# Altium project DIOT-mini-backplane.PrjPCB
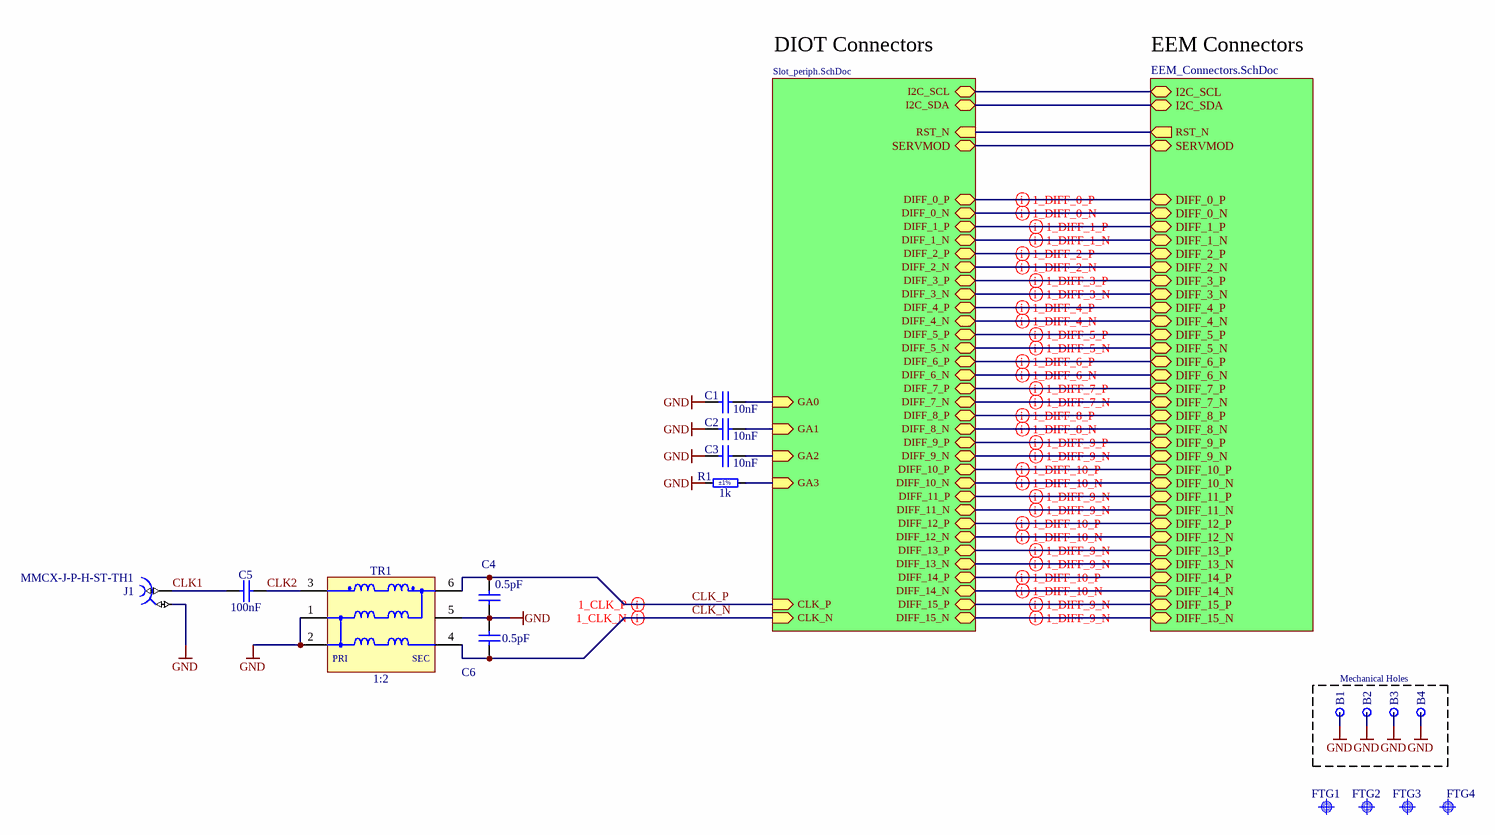
[diagram p0: DIOT-mini-backplane.SchDoc]
Addr1: WUT ISE; Addr2: Nowowiejska 15/19 00-665 Warsaw; LastMod: F.Switakowski; rev: 1.0.0; title_: DI/OT Backplane
3 sheets, 42 parts. Net scope: hierarchical (ports join the sheet entries above them; power ports are global).
Board file: DIOT-mini-backplane.pcbdoc
Sheets:
  DIOT-mini-backplane.SchDoc
    Peripheral Slot 1 = Slot_periph.SchDoc
    U_LVDS_EEM0 = EEM_Connectors.SchDoc

## Sheet DIOT-mini-backplane.SchDoc: =title_
size 594 x 420 mm; Date: 24/04/2023; CheckedBy: EG; GD; GK; MS; DrawnBy: M. Gąska; Address1: WUT ISE; Address2: Nowowiejska 15/19 00-665 Warsaw; DocumentNumber: 1; Revision: 1.0.0; SheetNumber: 1; SheetTotal: 5; DivGrp: BE-CO; Projet: DI/OT Crate; Title2: Top; Designer: G.Daniluk; ModifiedBy: F.Switakowski; CreateDate: 24/04/2023; CheckedDate: 24/04/2023

### Parts
B1  Non Plated Hole  [MTG270_500_NPTH_8FCVIAS_BOTSM]  (value not drawn)  (no BOM)
B2  Non Plated Hole  [MTG270_500_NPTH_8FCVIAS_BOTSM]  (value not drawn)  (no BOM)
B3  Non Plated Hole  [MTG270_500_NPTH_8FCVIAS_BOTSM]  (value not drawn)  (no BOM)
B4  Non Plated Hole  [MTG270_500_NPTH_8FCVIAS_BOTSM]  (value not drawn)  (no BOM)
C1  10nF  [CAPC1005X55N]
C2  10nF  [CAPC1005X55N]
C3  10nF  [CAPC1005X55N]
C4  0.5pF  [CAPC1005X50N]
C5  100nF  [CAPC1005X55N]
C6  0.5pF  [CAPC1005X50N]
FTG1  Use only in PCB  [FIDUCIAL_TOP_C100-200]  (value not drawn)  (no BOM)
FTG2  Use only in PCB  [FIDUCIAL_TOP_C100-200]  (value not drawn)  (no BOM)
FTG3  Use only in PCB  [FIDUCIAL_TOP_C100-200]  (value not drawn)  (no BOM)
FTG4  Use only in PCB  [FIDUCIAL_TOP_C100-200]  (value not drawn)  (no BOM)
J1  MMCX-J-P-H-ST-TH1  [SAMTEC_MMCX-J-P-H-ST-TH1]
R1  1k  Tolerance: ±1%  [RESC1005X40N]
TR1  1:2  [XFMR_MINI-CIRCUITS_DB1627]

### Blocks framed on the sheet
Mechanical Holes: B1-B4

### Sub-sheets
Peripheral Slot 1 = Slot_periph.SchDoc: I2C_SDA (bidir), I2C_SCL (bidir), GA3 (in), GA1 (in), GA2 (in), GA0 (in), RST_N (in), DIFF_2_P (bidir), DIFF_2_N (bidir), DIFF_0_P (bidir), DIFF_0_N (bidir), DIFF_1_P (bidir), DIFF_1_N (bidir), DIFF_5_P (bidir), DIFF_5_N (bidir), DIFF_6_P (bidir), DIFF_6_N (bidir), DIFF_8_P (bidir), DIFF_8_N (bidir), DIFF_9_P (bidir), DIFF_9_N (bidir), DIFF_10_P (bidir), DIFF_10_N (bidir), DIFF_7_P (bidir), DIFF_7_N (bidir), DIFF_4_N (bidir), DIFF_4_P (bidir), DIFF_3_N (bidir), DIFF_3_P (bidir), CLK_N (in), CLK_P (in), DIFF_14_N (bidir), DIFF_15_P (bidir), DIFF_11_P (bidir), DIFF_11_N (bidir), DIFF_12_P (bidir), DIFF_12_N (bidir), DIFF_13_P (bidir), DIFF_13_N (bidir), DIFF_14_P (bidir), DIFF_15_N (bidir), SERVMOD (bidir)  | J8_Ref: J8; #PWR095_Ref: #PWR095; #PWR0132_Ref: #PWR0132; #PWR0139_Ref: #PWR0139; #PWR0146_Ref: #PWR0146; #PWR092_Ref: #PWR092; #PWR098_Ref: #PWR098; #PWR0135_Ref: #PWR0135; #PWR093_Ref: #PWR093; #PWR099_Ref: #PWR099; #PWR0136_Ref: #PWR0136; #PWR0143_Ref: #PWR0143; #PWR096_Ref: #PWR096; #PWR0133_Ref: #PWR0133; #PWR0140_Ref: #PWR0140; #PWR0147_Ref: #PWR0147; #PWR094_Ref: #PWR094; #PWR0100_Ref: #PWR0100; #PWR0137_Ref: #PWR0137; #PWR0144_Ref: #PWR0144; J40_Ref: J40; #PWR0101_Ref: #PWR0101; #PWR0102_Ref: #PWR0102; #PWR0103_Ref: #PWR0103; #PWR0104_Ref: #PWR0104; #PWR0109_Ref: #PWR0109; #PWR0110_Ref: #PWR0110; #PWR0111_Ref: #PWR0111; #PWR0112_Ref: #PWR0112; #PWR0113_Ref: #PWR0113; #PWR0114_Ref: #PWR0114; #PWR0115_Ref: #PWR0115; #PWR0116_Ref: #PWR0116; #PWR0117_Ref: #PWR0117; #PWR0118_Ref: #PWR0118; #PWR0119_Ref: #PWR0119; #PWR0120_Ref: #PWR0120; #PWR0121_Ref: #PWR0121; #PWR0122_Ref: #PWR0122; #PWR0123_Ref: #PWR0123; #PWR0124_Ref: #PWR0124; #PWR0125_Ref: #PWR0125; #PWR0126_Ref: #PWR0126; #PWR0127_Ref: #PWR0127; #PWR0128_Ref: #PWR0128; #PWR0129_Ref: #PWR0129; #PWR0130_Ref: #PWR0130; #PWR0179_Ref: #PWR0179; #PWR0185_Ref: #PWR0185; #PWR0192_Ref: #PWR0192; #PWR0199_Ref: #PWR0199; #PWR0200_Ref: #PWR0200; #PWR0232_Ref: #PWR0232; #PWR0142_Ref: #PWR0142; #PWR042_Ref: #PWR042; #PWR046_Ref: #PWR046; #PWR091_Ref: #PWR091; #PWR097_Ref: #PWR097; #PWR0131_Ref: #PWR0131; #PWR0134_Ref: #PWR0134; #PWR0138_Ref: #PWR0138; #PWR044_Ref: #PWR044; #PWR01167_Ref: #PWR01167; #PWR01169_Ref: #PWR01169; #PWR01296_Ref: #PWR01296; #PWR01297_Ref: #PWR01297; #PWR01295_Ref: #PWR01295; #PWR01171_Ref: #PWR01171; #PWR01165_Ref: #PWR01165; #PWR01163_Ref: #PWR01163; J23_Ref: J23; J7_Ref: J7; #PWR061_Ref: #PWR061; #PWR070_Ref: #PWR070; #PWR079_Ref: #PWR079; #PWR088_Ref: #PWR088; #PWR057_Ref: #PWR057; #PWR066_Ref: #PWR066; #PWR075_Ref: #PWR075; #PWR084_Ref: #PWR084; #PWR062_Ref: #PWR062; #PWR071_Ref: #PWR071; #PWR080_Ref: #PWR080; #PWR089_Ref: #PWR089; #PWR058_Ref: #PWR058; #PWR067_Ref: #PWR067; #PWR076_Ref: #PWR076; #PWR085_Ref: #PWR085; #PWR069_Ref: #PWR069; #PWR078_Ref: #PWR078; #PWR087_Ref: #PWR087; #PWR063_Ref: #PWR063; #PWR072_Ref: #PWR072; #PWR081_Ref: #PWR081; #PWR090_Ref: #PWR090; #PWR059_Ref: #PWR059; #PWR068_Ref: #PWR068; #PWR077_Ref: #PWR077; #PWR086_Ref: #PWR086; #PWR060_Ref: #PWR060; #PWR064_Ref: #PWR064; #PWR073_Ref: #PWR073; #PWR082_Ref: #PWR082; #PWR055_Ref: #PWR055; #PWR051_Ref: #PWR051; #PWR035_Ref: #PWR035; #PWR054_Ref: #PWR054; #PWR047_Ref: #PWR047; #PWR023_Ref: #PWR023; #PWR012_Ref: #PWR012; #PWR050_Ref: #PWR050; #PWR033_Ref: #PWR033; #PWR017_Ref: #PWR017; #PWR07_Ref: #PWR07; #PWR053_Ref: #PWR053; #PWR045_Ref: #PWR045; #PWR021_Ref: #PWR021; #PWR010_Ref: #PWR010; #PWR049_Ref: #PWR049; #PWR031_Ref: #PWR031; #PWR016_Ref: #PWR016; #PWR06_Ref: #PWR06; #PWR052_Ref: #PWR052; #PWR043_Ref: #PWR043; #PWR019_Ref: #PWR019; #PWR08_Ref: #PWR08; #PWR048_Ref: #PWR048; #PWR029_Ref: #PWR029; #PWR014_Ref: #PWR014; #PWR05_Ref: #PWR05; #PWR04_Ref: #PWR04; #PWR03_Ref: #PWR03; #PWR02_Ref: #PWR02; #PWR01_Ref: #PWR01
U_LVDS_EEM0 = EEM_Connectors.SchDoc: DIFF_0_P (bidir), DIFF_0_N (bidir), DIFF_7_P (bidir), DIFF_7_N (bidir), DIFF_8_P (bidir), DIFF_8_N (bidir), DIFF_9_P (bidir), DIFF_9_N (bidir), DIFF_10_P (bidir), DIFF_10_N (bidir), DIFF_5_P (bidir), DIFF_5_N (bidir), DIFF_6_P (bidir), DIFF_6_N (bidir), DIFF_2_P (bidir), DIFF_2_N (bidir), DIFF_3_P (bidir), DIFF_3_N (bidir), DIFF_4_P (bidir), DIFF_4_N (bidir), DIFF_1_P (bidir), DIFF_1_N (bidir), DIFF_11_P (bidir), DIFF_11_N (bidir), DIFF_12_P (bidir), DIFF_12_N (bidir), DIFF_13_P (bidir), DIFF_13_N (bidir), DIFF_14_P (bidir), DIFF_14_N (bidir), DIFF_15_P (bidir), DIFF_15_N (bidir), I2C_SCL (bidir), I2C_SDA (bidir), RST_N (out), SERVMOD (bidir)

### Nets
GND: B1.1 B2.1 B3.1 B4.1 C1.1 C2.1 C3.1 C4.1 C6.2 J1.2 R1.1 TR1.1(P1) TR1.2(P1) TR1.5(NC)
CLK1: C5.1 J1.1
CLK2: C5.2 TR1.3(P1)
CLK_N: C6.1 TR1.4(S1) ; sheet Peripheral Slot 1/CLK_N
CLK_P: C4.2 TR1.6(S1) ; sheet Peripheral Slot 1/CLK_P
DIFF_0_N: sheet Peripheral Slot 1/DIFF_0_N, sheet U_LVDS_EEM0/DIFF_0_N
DIFF_0_P: sheet Peripheral Slot 1/DIFF_0_P, sheet U_LVDS_EEM0/DIFF_0_P
DIFF_1_N: sheet Peripheral Slot 1/DIFF_1_N, sheet U_LVDS_EEM0/DIFF_1_N
DIFF_1_P: sheet Peripheral Slot 1/DIFF_1_P, sheet U_LVDS_EEM0/DIFF_1_P
DIFF_2_N: sheet Peripheral Slot 1/DIFF_2_N, sheet U_LVDS_EEM0/DIFF_2_N
DIFF_2_P: sheet Peripheral Slot 1/DIFF_2_P, sheet U_LVDS_EEM0/DIFF_2_P
DIFF_3_N: sheet Peripheral Slot 1/DIFF_3_N, sheet U_LVDS_EEM0/DIFF_3_N
DIFF_3_P: sheet Peripheral Slot 1/DIFF_3_P, sheet U_LVDS_EEM0/DIFF_3_P
DIFF_4_N: sheet Peripheral Slot 1/DIFF_4_N, sheet U_LVDS_EEM0/DIFF_4_N
DIFF_4_P: sheet Peripheral Slot 1/DIFF_4_P, sheet U_LVDS_EEM0/DIFF_4_P
DIFF_5_N: sheet Peripheral Slot 1/DIFF_5_N, sheet U_LVDS_EEM0/DIFF_5_N
DIFF_5_P: sheet Peripheral Slot 1/DIFF_5_P, sheet U_LVDS_EEM0/DIFF_5_P
DIFF_6_N: sheet Peripheral Slot 1/DIFF_6_N, sheet U_LVDS_EEM0/DIFF_6_N
DIFF_6_P: sheet Peripheral Slot 1/DIFF_6_P, sheet U_LVDS_EEM0/DIFF_6_P
DIFF_7_N: sheet Peripheral Slot 1/DIFF_7_N, sheet U_LVDS_EEM0/DIFF_7_N
DIFF_7_P: sheet Peripheral Slot 1/DIFF_7_P, sheet U_LVDS_EEM0/DIFF_7_P
DIFF_8_N: sheet Peripheral Slot 1/DIFF_8_N, sheet U_LVDS_EEM0/DIFF_8_N
DIFF_8_P: sheet Peripheral Slot 1/DIFF_8_P, sheet U_LVDS_EEM0/DIFF_8_P
DIFF_9_N: sheet Peripheral Slot 1/DIFF_9_N, sheet U_LVDS_EEM0/DIFF_9_N
DIFF_9_P: sheet Peripheral Slot 1/DIFF_9_P, sheet U_LVDS_EEM0/DIFF_9_P
DIFF_10_N: sheet Peripheral Slot 1/DIFF_10_N, sheet U_LVDS_EEM0/DIFF_10_N
DIFF_10_P: sheet Peripheral Slot 1/DIFF_10_P, sheet U_LVDS_EEM0/DIFF_10_P
DIFF_11_N: sheet Peripheral Slot 1/DIFF_11_N, sheet U_LVDS_EEM0/DIFF_11_N
DIFF_11_P: sheet Peripheral Slot 1/DIFF_11_P, sheet U_LVDS_EEM0/DIFF_11_P
DIFF_12_N: sheet Peripheral Slot 1/DIFF_12_N, sheet U_LVDS_EEM0/DIFF_12_N
DIFF_12_P: sheet Peripheral Slot 1/DIFF_12_P, sheet U_LVDS_EEM0/DIFF_12_P
DIFF_13_N: sheet Peripheral Slot 1/DIFF_13_N, sheet U_LVDS_EEM0/DIFF_13_N
DIFF_13_P: sheet Peripheral Slot 1/DIFF_13_P, sheet U_LVDS_EEM0/DIFF_13_P
DIFF_14_N: sheet Peripheral Slot 1/DIFF_14_N, sheet U_LVDS_EEM0/DIFF_14_N
DIFF_14_P: sheet Peripheral Slot 1/DIFF_14_P, sheet U_LVDS_EEM0/DIFF_14_P
DIFF_15_N: sheet Peripheral Slot 1/DIFF_15_N, sheet U_LVDS_EEM0/DIFF_15_N
DIFF_15_P: sheet Peripheral Slot 1/DIFF_15_P, sheet U_LVDS_EEM0/DIFF_15_P
GA0: C1.2 ; sheet Peripheral Slot 1/GA0
GA1: C2.2 ; sheet Peripheral Slot 1/GA1
GA2: C3.2 ; sheet Peripheral Slot 1/GA2
GA3: R1.2 ; sheet Peripheral Slot 1/GA3
I2C_SCL: sheet Peripheral Slot 1/I2C_SCL, sheet U_LVDS_EEM0/I2C_SCL
I2C_SDA: sheet Peripheral Slot 1/I2C_SDA, sheet U_LVDS_EEM0/I2C_SDA
RST_N: sheet Peripheral Slot 1/RST_N, sheet U_LVDS_EEM0/RST_N
SERVMOD: sheet Peripheral Slot 1/SERVMOD, sheet U_LVDS_EEM0/SERVMOD

### Layout directives
differential pair; differential pair class DIFF_CLK; net class CLK; net class CLK: CLK_P
differential pair; differential pair class DIFF_CLK; net class CLK: CLK_N
differential pair; differential pair class DIFF_SIGNAL; net class SIGNAL; net class SIGNAL: DIFF_0_P
differential pair; differential pair class DIFF_SIGNAL; net class SIGNAL: DIFF_0_N, DIFF_1_N, DIFF_1_P, DIFF_2_N, DIFF_2_P, DIFF_3_N, DIFF_3_P, DIFF_4_N, DIFF_4_P, DIFF_5_N, DIFF_5_P, DIFF_6_N, DIFF_6_P, DIFF_7_N, DIFF_7_P, DIFF_8_N, DIFF_8_P, DIFF_9_N, DIFF_9_P, DIFF_10_N, DIFF_10_P, DIFF_11_N, DIFF_11_P, DIFF_12_N, DIFF_12_P, DIFF_13_N, DIFF_13_P, DIFF_14_N, DIFF_14_P, DIFF_15_N, DIFF_15_P

### Notes on the sheet
- DIOT Connectors
- EEM Connectors
- Project/Equipment
- Document
- File
- Designer
- Drawn by
- Check.by
- Last Mod.
- Copyright WUT ISE 2024.
  This documentation describes Open Hardware and is licensed under the CERN OHL-W v.2.0. You may redistribute and modify this documentation under the terms of the CERN OHL-W v.2.0. (http://ohwr.org/CERNOHL). This documentation is distributed WITHOUT ANY EXPRESS OR IMPLIED WARRANTY, INCLUDING OF MERCHANTABILITY, SATISFACTORY QUALITY AND FITNESS FOR A PARTICULAR PURPOSE. Please see the CERN OHL v.2.0 for applicable conditions.
- Contact
- Print Date
- Sheet
- Size
- A2
- of
- Rev
- (in symbol XFMR_MINI-CIRCUITS_TCM2-43X+) PRI; SEC

### Library data of the parts
B1-B4 = NON-PLATED_HOLE2.7_PAD5.0_8FCVIAS_BOTSM: Single Terminal Socket; Part Description: Plated Through Hole: Hole Dia.=2.7mm Pad Dia.=5.0mmUnplated Through Hole: Hole Dia.=2.7mm Pad Dia.=5.0mm with 8 vias filled and capped and soldermask on Bottom.; Mounted: No; Part Number: NON-PLATED_HOLE2.7_PAD5.0_8FCVIAS_BOTSM; Component Type: Standard (No BOM); Pin Count: 1; Family: Non Plated Hole; Socket: No; SMD: No; Sense: No; Status: None; ComponentHeight: 0mm; HelpURL: Undefined; Author: CERN DEM WB; CreateDate: 18/04/2024; LatestRevisionDate: 18/04/2024; PackageDescription: Unplated Through Hole: Hole Dia.=2.7mm Pad Dia.=5.0mm with 8 vias filled and capped and soldermask on Bottom.
C1-C3 = CC0402_10NF_16V_10%_X7R: Non-polarised capacitor; Part Description: SMD Multilayer Chip Ceramic Capacitor; Manufacturer: GENERIC; Manufacturer1 Part Number: 223878715636; Voltage: 16V; TC: X7R; Tolerance: ±10%; Part Number: CC0402_10NF_16V_10%_X7R; Component Kind: Standard; Component Type: Standard; Pin Count: 2; Value: 10nF; Status: Not Recommended; Manufacturer Part Number: CC0402_10NF_16V_10%_X7R; Case: 0402; Mounted: Yes; Socket: No; SMD: Yes; Sense: No; Manufacturer1 Example: PHYCOMP; Manufacturer1 ComponentHeight: 0.55mm; HelpURL: \\cern.ch\dfs\Applications\Altium\Datasheets\CC0402_X7R_PHYCOMP.pdf; Author: CERN DEM JLC; CreateDate: 03/12/2007; LatestRevisionDate: 03/12/2007
C4 C6 = CC0402_0.5PF_25V_0.05PF_AVX_04023J0R5ABSTR: Non-polarised capacitor; Part Description: Thin-Film Chip Capacitors for RF Signal and Power Applications, Accu-P Series; Manufacturer: AVX; Voltage: 25V; Tolerance: ±0.05pF; Part Number: CC0402_0.5PF_25V_0.05PF_AVX_04023J0R5ABSTR; Component Kind: Standard; Component Type: Standard; Pin Count: 2; Value: 0.5pF; Status: None; Manufacturer Part Number: 04023J0R5ABSTR; Case: 0402; Mounted: Yes; Socket: No; SMD: Yes; Sense: No; ComponentHeight: 0.5mm; HelpURL: \\cern.ch\dfs\Applications\Altium\Datasheets\CC0402_AVX_ACCU-P.pdf; Author: CERN DEM JLC; CreateDate: 2017-02-22; LatestRevisionDate: 2017-02-22
C5 = CC0402_100NF_16V_10%_X7R: Non-polarised capacitor; Part Description: SMD Multilayer Chip Ceramic Capacitor; Manufacturer: GENERIC; Manufacturer1 Part Number: GRM155R71C104KA88D; Voltage: 16V; TC: X7R; Tolerance: ±10%; Part Number: CC0402_100NF_16V_10%_X7R; Component Kind: Standard; Component Type: Standard; Pin Count: 2; Value: 100nF; Status: Not Recommended; Manufacturer Part Number: CC0402_100NF_16V_10%_X7R; Case: 0402; Mounted: Yes; Socket: No; SMD: Yes; Sense: No; Manufacturer1 Example: MURATA; Manufacturer1 ComponentHeight: 0.55mm; HelpURL: \\cern.ch\dfs\Applications\Altium\Datasheets\CC0402_X7R_MURATA_GRM.pdf; Author: CERN DEM JLC; CreateDate: 05.12.2013; LatestRevisionDate: 03.12.2007
FTG1-FTG4 = FIDUCIAL_TARGET_c100-200: Fiducial Target; Part Description: Round Fiducial Target, Top Layer, 1.0mm, Top Solder 2.0mm, Keepout =2.0mm; Mounted: No; Part Number: FIDUCIAL_TARGET_C100-200; Component Type: Standard (No BOM); Pin Count: 1; Family: Fiducial; Socket: No; SMD: Yes; Sense: No; Status: None; ComponentHeight: 0mm; HelpURL: Undefined; Author: CERN DEM JLC; CreateDate: 09/02/2010; LatestRevisionDate: 04/04/2012; PackageDescription: Round Fiducial Target, Top Layer, 1.0mm, Top Solder 2.0mm, Keepout =2.0mm
J1 = SAMTEC_MMCX-J-P-H-ST-TH1: Part Description: Straight Through-hole 50 Ohm Micro Mini RF Jack, MMCX Series; Manufacturer: SAMTEC; PressFit: No; Part Number: SAMTEC_MMCX-J-P-H-ST-TH1; Component Kind: Standard; Component Type: Standard; Pin Count: 2; Mounted: Yes; Socket: No; Sense: No; SMD: No; Status: None; Manufacturer Part Number: MMCX-J-P-H-ST-TH1; ComponentHeight: 4.35mm; HelpURL: \\cern.ch\dfs\Applications\Altium\Datasheets\SAMTEC_MMCX-J-P-H-ST-TH1.pdf; Author: CERN DEM JLC; CreateDate: 05.12.2012; LatestRevisionDate: 05.12.2012
R1 = R0402_1K_1%_0.0625W_100PPM: Resistor - 1%; Part Description: General Purpose Thick Film Chip Resistor; Manufacturer: GENERIC; Manufacturer1 Part Number: 232270671002L; TC: ±100ppm/°C; PressFit: No; Part Number: R0402_1K_1%_0.0625W_100PPM; Component Kind: Standard; Component Type: Standard; Pin Count: 2; Value: 1k; Status: Not Recommended; Power: 0.0625W; Manufacturer Part Number: R0402_1K_1%_0.0625W_100PPM; Case: 0402; Mounted: Yes; Sense: No; Socket: No; SMD: Yes; Manufacturer1 Example: YAGEO PHYCOMP; Manufacturer1 ComponentHeight: 0.4mm; HelpURL: \\cern.ch\dfs\Applications\Altium\Datasheets\R0402_Phycomp_RC0402.pdf; Author: CERN DEM JLC; CreateDate: 03/12/2007; LatestRevisionDate: 17/10/2012
TR1 = XFMR_MINI-CIRCUITS_TCM2-43X+: 50 OHMS 10 to 4000 MHz RF Transformer; Power: 0.4W; Part Number: XFMR_MINI-CIRCUITS_TCM2-43X+; Component Kind: Standard; Component Type: Standard; Pin Count: 6; Value: 1:2; Status: None; Part Description: 50 Ohms 10 to 4000MHz RF Transformer; Manufacturer: MINI-CIRCUITS; Manufacturer Part Number: TCM2-43X+; Mounted: Yes; Socket: No; Sense: No; SMD: Yes; ComponentHeight: 4.06mm; HelpURL: \\cern.ch\dfs\Applications\Altium\Datasheets\XFMR_MINI-CIRCUITS_TCM2-43X+.pdf; Author: CERN DEM BC; CreateDate: 2016-02-12; LatestRevisionDate: 2016-02-12

## Sheet Slot_periph.SchDoc: =title_
size 594 x 420 mm; Date: 06/04/2023; CheckedBy: EG; GD; GK; MS; DrawnBy: M. Gąska; Address1: WUT ISE; Address2: Nowowiejska 15/19 00-665 Warsaw; DocumentNumber: 5; Revision: 1.0.0; SheetNumber: 5; SheetTotal: 5; Title2: Slot periph; DivGrp: BE-CO; Projet: DI/OT Crate; Designer: G.Daniluk; ModifiedBy: F.Switakowski; CreateDate: 06/04/2023; CheckedDate: 06/04/2023
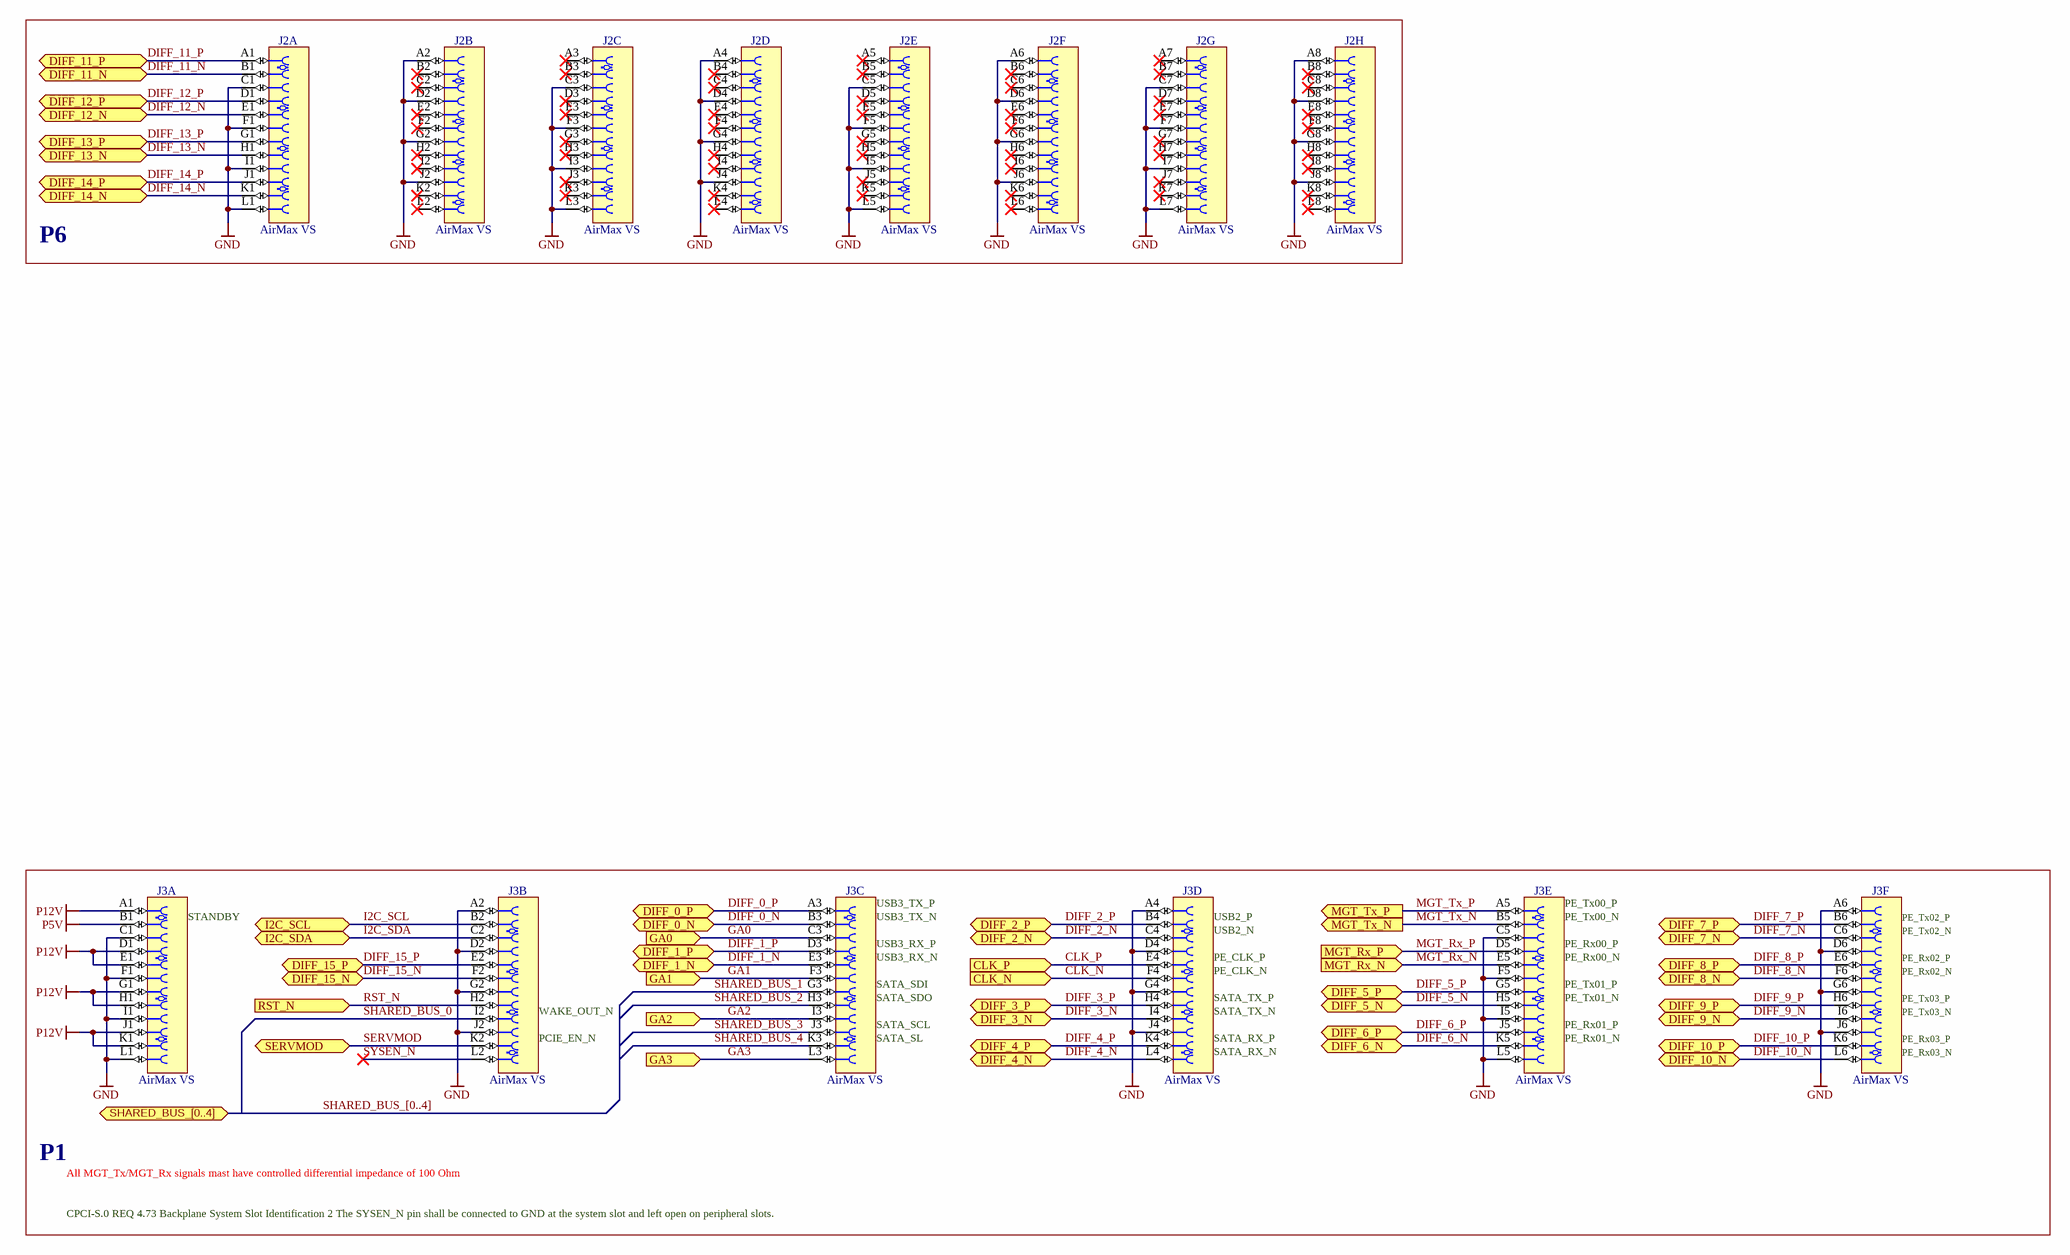
[diagram p1: Slot_periph.SchDoc]

### Parts
J2  AirMax VS  [AMPHENOL_10052842-101LF]  (parts A,B,C,D,E,F,G,H of 8)
J3  AirMax VS  [AMPHENOL_10052829-101LF]  (parts A,B,C,D,E,F of 6)

### Blocks framed on the sheet
P6: J2
P1: J3

### Ports
CLK_N (in), CLK_P (in), DIFF_0_N (bidir), DIFF_0_P (bidir), DIFF_1_N (bidir), DIFF_1_P (bidir), DIFF_2_N (bidir), DIFF_2_P (bidir), DIFF_3_N (bidir), DIFF_3_P (bidir), DIFF_4_N (bidir), DIFF_4_P (bidir), DIFF_5_N (bidir), DIFF_5_P (bidir), DIFF_6_N (bidir), DIFF_6_P (bidir), DIFF_7_N (bidir), DIFF_7_P (bidir), DIFF_8_N (bidir), DIFF_8_P (bidir), DIFF_9_N (bidir), DIFF_9_P (bidir), DIFF_10_N (bidir), DIFF_10_P (bidir), DIFF_11_N (bidir), DIFF_11_P (bidir), DIFF_12_N (bidir), DIFF_12_P (bidir), DIFF_13_N (bidir), DIFF_13_P (bidir), DIFF_14_N (bidir), DIFF_14_P (bidir), DIFF_15_N (bidir), DIFF_15_P (bidir), GA0 (in), GA1 (in), GA2 (in), GA3 (in), I2C_SCL (bidir), I2C_SDA (bidir), MGT_Rx_N (in), MGT_Rx_P (in), MGT_Tx_N (out), MGT_Tx_P (out), RST_N (in), SERVMOD (bidir), SHARED_BUS_[0..4] (bidir)

### Nets
GND: J2.A2 J2.A4 J2.A6 J2.A8 J2.C1 J2.C3 J2.C5 J2.C7 J2.D2 J2.D4 J2.D6 J2.D8 J2.F1 J2.F3 J2.F5 J2.F7 J2.G2 J2.G4 J2.G6 J2.G8 J2.I1 J2.I3 J2.I5 J2.I7 J2.J2 J2.J4 J2.J6 J2.J8 J2.L1 J2.L3 J2.L5 J2.L7 J3.A2 J3.A4 J3.A6 J3.C1 J3.C5 J3.D2 J3.D4 J3.D6 J3.F1 J3.F5 J3.G2 J3.G4 J3.G6 J3.I1 J3.I5 J3.J2 J3.J4 J3.J6 J3.L1 J3.L5
P5V: J3.B1
P12V: J3.A1 J3.D1 J3.E1 J3.G1 J3.H1 J3.J1 J3.K1
CLK_N: J3.F4 ; port CLK_N
CLK_P: J3.E4 ; port CLK_P
DIFF_0_N: J3.B3 ; port DIFF_0_N
DIFF_0_P: J3.A3 ; port DIFF_0_P
DIFF_1_N: J3.E3 ; port DIFF_1_N
DIFF_1_P: J3.D3 ; port DIFF_1_P
DIFF_2_N: J3.C4 ; port DIFF_2_N
DIFF_2_P: J3.B4 ; port DIFF_2_P
DIFF_3_N: J3.I4 ; port DIFF_3_N
DIFF_3_P: J3.H4 ; port DIFF_3_P
DIFF_4_N: J3.L4 ; port DIFF_4_N
DIFF_4_P: J3.K4 ; port DIFF_4_P
DIFF_5_N: J3.H5 ; port DIFF_5_N
DIFF_5_P: J3.G5 ; port DIFF_5_P
DIFF_6_N: J3.K5 ; port DIFF_6_N
DIFF_6_P: J3.J5 ; port DIFF_6_P
DIFF_7_N: J3.C6 ; port DIFF_7_N
DIFF_7_P: J3.B6 ; port DIFF_7_P
DIFF_8_N: J3.F6 ; port DIFF_8_N
DIFF_8_P: J3.E6 ; port DIFF_8_P
DIFF_9_N: J3.I6 ; port DIFF_9_N
DIFF_9_P: J3.H6 ; port DIFF_9_P
DIFF_10_N: J3.L6 ; port DIFF_10_N
DIFF_10_P: J3.K6 ; port DIFF_10_P
DIFF_11_N: J2.B1 ; port DIFF_11_N
DIFF_11_P: J2.A1 ; port DIFF_11_P
DIFF_12_N: J2.E1 ; port DIFF_12_N
DIFF_12_P: J2.D1 ; port DIFF_12_P
DIFF_13_N: J2.H1 ; port DIFF_13_N
DIFF_13_P: J2.G1 ; port DIFF_13_P
DIFF_14_N: J2.K1 ; port DIFF_14_N
DIFF_14_P: J2.J1 ; port DIFF_14_P
DIFF_15_N: J3.F2 ; port DIFF_15_N
DIFF_15_P: J3.E2 ; port DIFF_15_P
GA0: J3.C3 ; port GA0
GA1: J3.F3 ; port GA1
GA2: J3.I3 ; port GA2
GA3: J3.L3 ; port GA3
I2C_SCL: J3.B2 ; port I2C_SCL
I2C_SDA: J3.C2 ; port I2C_SDA
MGT_Rx_N: J3.E5 ; port MGT_Rx_N
MGT_Rx_P: J3.D5 ; port MGT_Rx_P
MGT_Tx_N: J3.B5 ; port MGT_Tx_N
MGT_Tx_P: J3.A5 ; port MGT_Tx_P
RST_N: J3.H2 ; port RST_N
SERVMOD: J3.K2 ; port SERVMOD
SHARED_BUS_0: J3.I2
SHARED_BUS_1: J3.G3
SHARED_BUS_2: J3.H3
SHARED_BUS_3: J3.J3
SHARED_BUS_4: J3.K3
SYSEN_N: J3.L2

Not connected (* = marked no-connect by the designer): J2 A3* A5* A7* B2* B3* B4* B5* B6* B7* B8* C2* C4* C6* C8* D3* D5* D7* E2* E3* E4* E5* E6* E7* E8* F2* F4* F6* F8* G3* G5* G7* H2* H3* H4* H5* H6* H7* H8* I2* I4* I6* I8* J3* J5* J7* K2* K3* K4* K5* K6* K7* K8* L2* L4* L6* L8*

### Buses and harness runs
bus SHARED_BUS_[0..4] = port SHARED_BUS_[0..4]

### Notes on the sheet
- (near J3) STANDBY
- (near J3) USB3_TX_P
- (near J3) USB3_TX_N
- (near J3) USB3_RX_P
- (near J3) USB3_RX_N
- (near J3) USB2_P
- (near J3) USB2_N
- (near J3) PE_CLK_P
- (near J3) PE_Tx00_P
- (near J3) PE_Tx00_N
- (near J3) PE_Rx00_P
- (near J3) PE_Rx00_N
- (near J3) PE_Rx02_P
- (near J3) PE_Tx02_N
- (near J3) PE_Tx02_P
- (near J3) WAKE_OUT_N
- (near J3) SATA_SDI
- (near J3) SATA_SDO
- (near J3) SATA_SCL
- (near J3) SATA_TX_P
- (near J3) SATA_TX_N
- (near J3) PE_CLK_N
- (near J3) PE_Rx01_P
- (near J3) PE_Tx01_N
- (near J3) PE_Tx01_P
- (near J3) PE_Tx03_P
- (near J3) PE_Tx03_N
- (near J3) PE_Rx02_N
- (near J3) PCIE_EN_N
- (near J3) SATA_SL
- (near J3) SATA_RX_P
- (near J3) SATA_RX_N
- (near J3) PE_Rx01_N
- (near J3) PE_Rx03_P
- (near J3) PE_Rx03_N
- All MGT_Tx/MGT_Rx signals mast have controlled differential impedance of 100 Ohm
- CPCI-S.0 REQ 4.73 Backplane System Slot Identification 2
  The SYSEN_N pin shall be connected to GND at the system slot and left open on peripheral slots.
- Project/Equipment
- Document
- File
- Designer
- Drawn by
- Check.by
- Last Mod.
- Copyright WUT ISE 2024.
  This documentation describes Open Hardware and is licensed under the CERN OHL-W v.2.0. You may redistribute and modify this documentation under the terms of the CERN OHL-W v.2.0. (http://ohwr.org/CERNOHL). This documentation is distributed WITHOUT ANY EXPRESS OR IMPLIED WARRANTY, INCLUDING OF MERCHANTABILITY, SATISFACTORY QUALITY AND FITNESS FOR A PARTICULAR PURPOSE. Please see the CERN OHL v.2.0 for applicable conditions.
- Contact
- Print Date
- Sheet
- Size
- A2
- of
- Rev

### Library data of the parts
J2 = AMPHENOL_10052842-101LF: 96 Contacts Receptacle, 8 Columns, 4 Pairs per Column; Part Description: 96 Contacts, 2mm Pitch, 8 Columns, 4 Pairs per Column, Vertical Receptacle; Part Number: AMPHENOL_10052842-101LF; Component Kind: Standard; Component Type: Standard; Pin Count: 96; Family: AirMax VS; Mounted: Yes; Socket: No; SMD: No; PressFit: Yes; Sense: No; Status: None; Manufacturer: AMPHENOL; Manufacturer Part Number: 10052842-101LF; ComponentHeight: 10.85mm; HelpURL: \\cern.ch\dfs\Applications\Altium\Datasheets\AMPHENOL_10052842-101LF.pdf; ComponentLink1URL: \\cern.ch\dfs\Applications\Altium\Datasheets\AMPHENOL_10052842-101LF_Application.pdf; ComponentLink1Description: Application; Author: CERN DEM MR; CreateDate: 30.04.2019; LatestRevisionDate: 30.04.2019
J3 = AMPHENOL_10052829-101LF: 72 Contacts Receptacle, 6 Columns, 4 Pairs per Column; Part Description: 72 Contacts, 2mm Pitch, 6 Columns, 4 Pairs per Column, Vertical Receptacle; Part Number: AMPHENOL_10052829-101LF; Component Kind: Standard; Component Type: Standard; Pin Count: 72; Family: AirMax VS; Mounted: Yes; Socket: No; SMD: No; PressFit: Yes; Sense: No; Status: None; Manufacturer: AMPHENOL; Manufacturer Part Number: 10052829-101LF; ComponentHeight: 10.85mm; HelpURL: \\cern.ch\dfs\Applications\Altium\Datasheets\AMPHENOL_10052829-101LF.pdf; ComponentLink1URL: \\cern.ch\dfs\Applications\Altium\Datasheets\AMPHENOL_10052829-101LF_Application.pdf; ComponentLink1Description: Application; Author: CERN DEM MR; CreateDate: 30.04.2019; LatestRevisionDate: 30.04.2019

## Sheet EEM_Connectors.SchDoc
size 420 x 297 mm; EDA_Number: ARTIQ; CompanyName: WUT ISE; Organization: WUT ISE; DocumentNumber: 5; SheetNumber: 11; Title2: EEM Connectors, JTAG switches; SPICEModelCacheVGBTAUBO: <root> / <DocumentId>VGBTAUBO</DocumentId> / </root>; ModifiedDate: -; ProjectName: DIOT-mini-backplane.PrjPCB
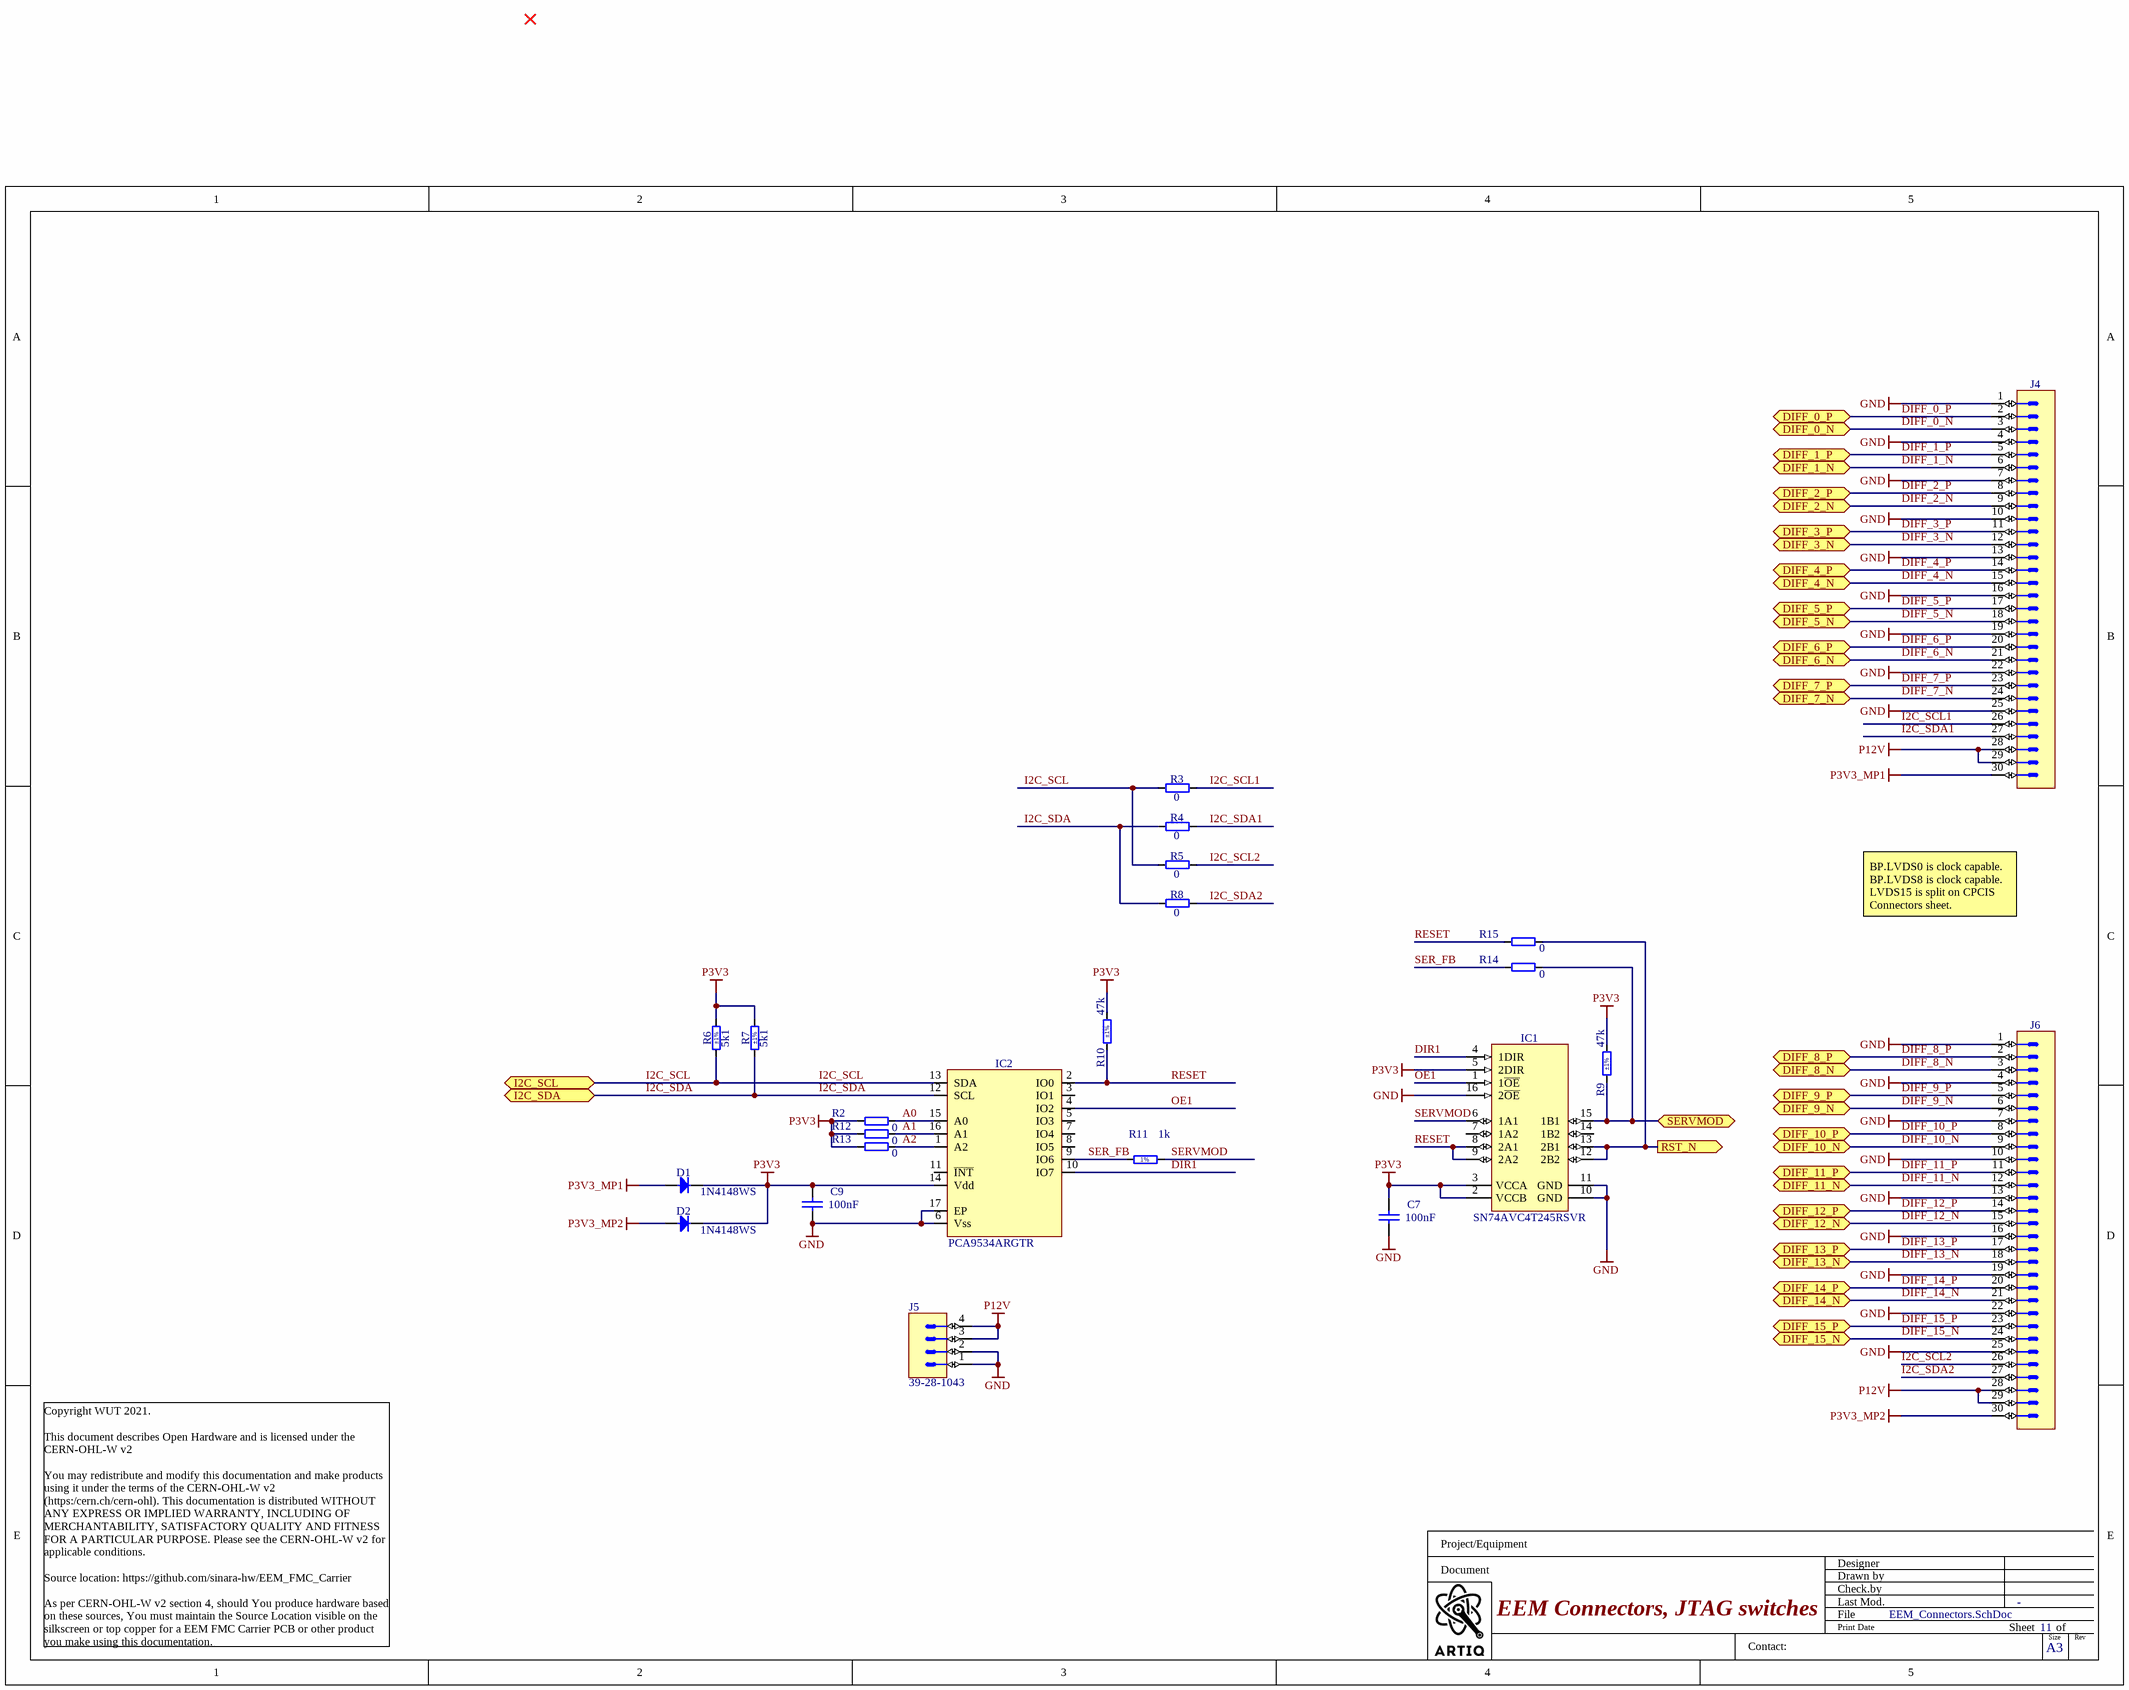
[diagram p2: EEM_Connectors.SchDoc]

### Parts
C7  100nF  [CAPC1005X55N]
C9  100nF  [CAPC1005X55N]
D1  1N4148WS  [SODFL2512X100N]
D2  1N4148WS  [SODFL2512X100N]
IC1  SN74AVC4T245RSVR  [QFN40P180X260X55-16N]
IC2  PCA9534ARGTR  [HVQFN-16]
J4  (no value)  [3M_N2530-6002RB]
J5  Manufacturer Part Number: 39-28-1043  [MOLEX_39-28-1043]  (hidden comment: Mini-Fit Jr.™)
J6  (no value)  [3M_N2530-6002RB]
R2  0  [RESC1005X40N]
R3  0  [RESC1005X40N]
R4  0  [RESC1005X40N]
R5  0  [RESC1005X40N]
R6  5k1  Tolerance: ±1%  [RESC1005X40N]
R7  5k1  Tolerance: ±1%  [RESC1005X40N]
R8  0  [RESC1005X40N]
R9  47k  Tolerance: ±1%  [RESC1005X40N]
R10  47k  Tolerance: ±1%  [RESC1005X40N]
R11  1k  [RESC1005X40N]
R12  0  [RESC1005X40N]
R13  0  [RESC1005X40N]
R14  0  [RESC1005X40N]
R15  0  [RESC1005X40N]

### Ports
DIFF_0_N (bidir), DIFF_0_P (bidir), DIFF_1_N (bidir), DIFF_1_P (bidir), DIFF_2_N (bidir), DIFF_2_P (bidir), DIFF_3_N (bidir), DIFF_3_P (bidir), DIFF_4_N (bidir), DIFF_4_P (bidir), DIFF_5_N (bidir), DIFF_5_P (bidir), DIFF_6_N (bidir), DIFF_6_P (bidir), DIFF_7_N (bidir), DIFF_7_P (bidir), DIFF_8_N (bidir), DIFF_8_P (bidir), DIFF_9_N (bidir), DIFF_9_P (bidir), DIFF_10_N (bidir), DIFF_10_P (bidir), DIFF_11_N (bidir), DIFF_11_P (bidir), DIFF_12_N (bidir), DIFF_12_P (bidir), DIFF_13_N (bidir), DIFF_13_P (bidir), DIFF_14_N (bidir), DIFF_14_P (bidir), DIFF_15_N (bidir), DIFF_15_P (bidir), I2C_SCL (bidir), I2C_SDA (bidir), RST_N (out), SERVMOD (bidir)

### Nets
GND: C7.2 C9.2 IC1.10(GND) IC1.11(GND) IC1.16(2~{OE}) IC2.6(Vss) IC2.17(EP) J4.1 J4.4 J4.7 J4.10 J4.13 J4.16 J4.19 J4.22 J4.25 J5.1 J5.2 J6.1 J6.4 J6.7 J6.10 J6.13 J6.16 J6.19 J6.22 J6.25
P3V3: C7.1 C9.1 D1.1(C) D2.1(C) IC1.2(VCCB) IC1.3(VCCA) IC1.5(2DIR) IC2.14(Vdd) R2.1 R6.2 R7.2 R9.2 R10.2 R12.1 R13.1
P3V3_MP1: D1.2(A) J4.30
P3V3_MP2: D2.2(A) J6.30
P12V: J4.28 J4.29 J5.3 J5.4 J6.28 J6.29
A0: IC2.15(A0) R2.2
A1: IC2.16(A1) R12.2
A2: IC2.1(A2) R13.2
DIFF_0_N: J4.3 ; port DIFF_0_N
DIFF_0_P: J4.2 ; port DIFF_0_P
DIFF_1_N: J4.6 ; port DIFF_1_N
DIFF_1_P: J4.5 ; port DIFF_1_P
DIFF_2_N: J4.9 ; port DIFF_2_N
DIFF_2_P: J4.8 ; port DIFF_2_P
DIFF_3_N: J4.12 ; port DIFF_3_N
DIFF_3_P: J4.11 ; port DIFF_3_P
DIFF_4_N: J4.15 ; port DIFF_4_N
DIFF_4_P: J4.14 ; port DIFF_4_P
DIFF_5_N: J4.18 ; port DIFF_5_N
DIFF_5_P: J4.17 ; port DIFF_5_P
DIFF_6_N: J4.21 ; port DIFF_6_N
DIFF_6_P: J4.20 ; port DIFF_6_P
DIFF_7_N: J4.24 ; port DIFF_7_N
DIFF_7_P: J4.23 ; port DIFF_7_P
DIFF_8_N: J6.3 ; port DIFF_8_N
DIFF_8_P: J6.2 ; port DIFF_8_P
DIFF_9_N: J6.6 ; port DIFF_9_N
DIFF_9_P: J6.5 ; port DIFF_9_P
DIFF_10_N: J6.9 ; port DIFF_10_N
DIFF_10_P: J6.8 ; port DIFF_10_P
DIFF_11_N: J6.12 ; port DIFF_11_N
DIFF_11_P: J6.11 ; port DIFF_11_P
DIFF_12_N: J6.15 ; port DIFF_12_N
DIFF_12_P: J6.14 ; port DIFF_12_P
DIFF_13_N: J6.18 ; port DIFF_13_N
DIFF_13_P: J6.17 ; port DIFF_13_P
DIFF_14_N: J6.21 ; port DIFF_14_N
DIFF_14_P: J6.20 ; port DIFF_14_P
DIFF_15_N: J6.24 ; port DIFF_15_N
DIFF_15_P: J6.23 ; port DIFF_15_P
DIR1: IC1.4(1DIR) IC2.10(IO7)
I2C_SCL: IC2.13(SDA) R3.1 R5.1 R6.1 ; port I2C_SCL
I2C_SCL1: J4.26 R3.2
I2C_SCL2: J6.26 R5.2
I2C_SDA: IC2.12(SCL) R4.1 R7.1 R8.1 ; port I2C_SDA
I2C_SDA1: J4.27 R4.2
I2C_SDA2: J6.27 R8.2
OE1: IC1.1(1~{OE}) IC2.4(IO2)
RESET: IC1.8(2A1) IC1.9(2A2) IC2.2(IO0) R10.1 R15.1
RST_N: IC1.12(2B2) IC1.13(2B1) R15.2 ; port RST_N
SER_FB: IC2.9(IO6) R11.1 R14.1
SERVMOD: IC1.15(1B1) R9.1 R14.2 ; port SERVMOD
SERVMOD: IC1.6(1A1) R11.2  [a separate net that carries the same name]

Not connected (* = marked no-connect by the designer): IC1 7(1A2) 14(1B2); IC2 3(IO1) 5(IO3) 7(IO4) 8(IO5) 11(~{INT})

### Notes on the sheet
- BP.LVDS0 is clock capable.
  BP.LVDS8 is clock capable.
  LVDS15 is split on CPCIS Connectors sheet.
- Project/Equipment
- Document
- Designer
- Drawn by
- Check.by
- Copyright WUT 2021.
  This document describes Open Hardware and is licensed under the CERN-OHL-W v2
  You may redistribute and modify this documentation and make products using it under the terms of the CERN-OHL-W v2 (https:/cern.ch/cern-ohl). This documentation is distributed WITHOUT ANY EXPRESS OR IMPLIED WARRANTY, INCLUDING OF MERCHANTABILITY, SATISFACTORY QUALITY AND FITNESS FOR A PARTICULAR PURPOSE. Please see the CERN-OHL-W v2 for applicable conditions.
  Source location: https://github.com/sinara-hw/EEM_FMC_Carrier
  As per CERN-OHL-W v2 section 4, should You produce hardware based on these sources, You must maintain the Source Location visible on the silkscreen or top copper for a EEM FMC Carrier PCB or other product you make using this documentation.
- Contact:
- File
- Last Mod.
- Print Date
- Sheet
- Size
- A3
- of
- Rev
- (in symbol R0402_1K_1%_0.0625W_100PPM) 1%

### Library data of the parts
C7 C9 = CC0402_100NF_25V_10%_X7R_YUDEN_TMK105B7104KVHF: Non-polarised capacitor; Part Description: SMD Multilayer Chip Ceramic Capacitor (High Dielectric Type) for Automotive / Industrial Applications; Manufacturer: TAIYO YUDEN; Voltage: 25V; TC: X7R; Tolerance: ±10%; Part Number: CC0402_100NF_25V_10%_X7R_YUDEN_TMK105B7104KVHF; Component Kind: Standard; Component Type: Standard; Pin Count: 2; Value: 100nF; Status: Not Recommended; Manufacturer Part Number: TMK105B7104KVHF; Case: 0402; Mounted: Yes; Socket: No; SMD: Yes; Sense: No; ComponentHeight: 0.55mm; HelpURL: \\cern.ch\dfs\Applications\Altium\Datasheets\CC0402_TAIYO-YUDEN_TMK105B7104KVHF.pdf; Author: CERN DEM JLC; CreateDate: 10.05.2017; LatestRevisionDate: 10.05.2017
D1 D2 = 1N4148WS: Diode; Part Description: Small Signal Diodes; Manufacturer: FAIRCHILD SEMICONDUCTOR; Voltage: 75V; Power: 150mA; PressFit: No; Bonding: No; Part Number: 1N4148WS; Component Kind: Standard; Component Type: Standard; Device: 1N4148WS; PackageDescription: SODFL Diode (SOD323F); 1.70mm W X 1.25mm L X 1.00mm H body, IPC Medium Density; Manufacturer Part Number: 1N4148WS; Pin Count: 2; Case: SOD-323F; Mounted: Yes; Socket: No; SMD: Yes; Sense: No; ComponentHeight: 1mm; HelpURL: \\cern.ch\dfs\Applications\Altium\Datasheets\1N4148WS.pdf; Author: CERN DEM JLC; CreateDate: 12.05.2011; LatestRevisionDate: 12.05.2011
IC1 = SN74AVC4T245RSVR: 4-Bit Dual-Supply Bus Transceiver with Configurable Voltage Translation and 3-State Output; Part Description: 4-Bit Dual-Supply Bus Transceiver with Configurable Voltage Translation and 3-State Outputs; Manufacturer: TEXAS INSTRUMENTS; PressFit: No; Bonding: No; Part Number: SN74AVC4T245RSVR; Component Kind: Standard; Component Type: Standard; Device: SN74AVC4T245RSVR; PackageDescription: QFN, 0.40mm Pitch, Rect.; 16 Pin, 2.60mm L X 1.80mm W X 0.55mm H Body, IPC Medium Density; Status: Not Recommended; Manufacturer Part Number: SN74AVC4T245RSVR; Pin Count: 16; Case: QFN16; Mounted: Yes; Socket: No; SMD: Yes; Sense: No; ComponentHeight: 0.55mm; Author: CERN DEM JLC; HelpURL: \\cern.ch\dfs\Applications\Altium\Datasheets\SN74AVC4T245RSVR.pdf; CreateDate: 08.07.2014; LatestRevisionDate: 30.03.2017
IC2 = PCA9534ARGTR: 8-bit I2C-bus and SMBus low power I/O port with interrupt; Manufacturer: NXP SEMICONDUCTORS; PressFit: No; Bonding: No; Part Number: PCA9534ARGTR; Component Kind: Standard; Component Type: Standard; Device: PCA9534ARGTR; PackageDescription: PCA9534ARGTR; Part Description: 8-bit I2C-bus and SMBus low power I/O port with interrupt; Manufacturer Part Number: PCA9534ARGTR; Pin Count: 16; Case: HVQFN-16; Mounted: Yes; Socket: No; SMD: Yes; Sense: No; ComponentHeight: 1.0mm; Author: CERN DEM BC; CreateDate: 2.01.2025; LatestRevisionDate: 2.01.2025
J4 J6 = 3M_N2530-6002RB: Connector 30 Male; Part Description: 30 Contacts - Straight .100'' x .100'' Low Profile Four-Wall Header, 2500 Series; Manufacturer: 3M; PressFit: No; Part Number: 3M_N2530-6002RB; Component Kind: Standard; Component Type: Standard; Pin Count: 30; Family: Header 30; Mounted: Yes; Socket: No; SMD: No; Sense: No; Status: None; Manufacturer Part Number: N2530-6002RB; ComponentHeight: 10.03mm; HelpURL: \\cern.ch\dfs\Applications\Altium\Datasheets\3M_N2530-6002RB.pdf; Author: CERN DEM JLC; CreateDate: 11.02.2009; LatestRevisionDate: 11.08.2009
J5 = MOLEX_39-28-1043: Connector 4 Male; Part Description: 4.20mm (.165") Pitch Mini-Fit Jr.™ Header, Dual Row, Vertical, without Snap-in Plastic Peg PCB Lock, 4 Circuits; Manufacturer: MOLEX; PressFit: No; Part Number: MOLEX_39-28-1043; Component Kind: Standard; Component Type: Standard; Pin Count: 4; Family: Mini-Fit Jr.™; Mounted: Yes; Socket: No; SMD: No; Sense: No; Status: None; ComponentHeight: 13.1mm; HelpURL: \\cern.ch\dfs\Applications\Altium\Datasheets\MOLEX_39-28-1043.pdf; Author: CERN DEM JLC; CreateDate: 12.03.2009; LatestRevisionDate: 06.03.2012
R2-R5 R8 R12-R15 = R0402_0R_JUMPER: Resistor; Part Description: 1A (0.05R Max DC Resistance) Zero Ohm Jumper; Manufacturer: GENERIC; Manufacturer1 Part Number: 232270591001L; PressFit: No; Part Number: R0402_0R_JUMPER; Component Kind: Standard; Component Type: Standard; Pin Count: 2; Value: 0; Status: Not Recommended; Manufacturer Part Number: R0402_0R_JUMPER; Case: 0402; Mounted: Yes; Sense: No; Socket: No; SMD: Yes; Manufacturer1 Example: YAGEO PHYCOMP; Manufacturer1 ComponentHeight: 0.4mm; HelpURL: \\cern.ch\dfs\Applications\Altium\Datasheets\R0402_Phycomp_RC0402.pdf; Author: CERN DEM JLC; CreateDate: 03.12.2007; LatestRevisionDate: 17.10.2012
R6 R7 = R0402_5K1_1%_0.0625W_100PPM: Resistor - 1%; Part Description: General Purpose Thick Film Chip Resistor; Manufacturer: GENERIC; Manufacturer1 Part Number: 232270675102L; TC: ±100ppm/°C; PressFit: No; Part Number: R0402_5K1_1%_0.0625W_100PPM; Component Kind: Standard; Component Type: Standard; Pin Count: 2; Value: 5k1; Status: Not Recommended; Power: 0.0625W; Manufacturer Part Number: R0402_5K1_1%_0.0625W_100PPM; Case: 0402; Mounted: Yes; Sense: No; Socket: No; SMD: Yes; Manufacturer1 Example: YAGEO PHYCOMP; Manufacturer1 ComponentHeight: 0.4mm; HelpURL: \\cern.ch\dfs\Applications\Altium\Datasheets\R0402_Phycomp_RC0402.pdf; Author: CERN DEM JLC; CreateDate: 03.12.2007; LatestRevisionDate: 17.10.2012
R9 R10 = R0402_47K_1%_0.0625W_100PPM: Resistor - 1%; Part Description: General Purpose Thick Film Chip Resistor; Manufacturer: GENERIC; Manufacturer1 Part Number: 232270674703L; TC: ±100ppm/°C; PressFit: No; Part Number: R0402_47K_1%_0.0625W_100PPM; Component Kind: Standard; Component Type: Standard; Pin Count: 2; Value: 47k; Status: Not Recommended; Power: 0.0625W; Manufacturer Part Number: R0402_47K_1%_0.0625W_100PPM; Case: 0402; Mounted: Yes; Sense: No; Socket: No; SMD: Yes; Manufacturer1 Example: YAGEO PHYCOMP; Manufacturer1 ComponentHeight: 0.4mm; HelpURL: \\cern.ch\dfs\Applications\Altium\Datasheets\R0402_Phycomp_RC0402.pdf; Author: CERN DEM JLC; CreateDate: 03.12.2007; LatestRevisionDate: 17.10.2012
R11 = R0402_1K_1%_0.0625W_100PPM: as R1 on sheet DIOT-mini-backplane; Part Number: R0402_1K_1%_0.0625W_100PPM; Component Kind: Standard; Component Type: Standard; Pin Count: 2; Value: 1k; Status: Not Recommended; Power: 0.0625W; Tolerance: ±1%; Manufacturer Part Number: R0402_1K_1%_0.0625W_100PPM; Case: 0402; Mounted: Yes; Sense: No; Socket: No; SMD: Yes; Manufacturer1 Example: YAGEO PHYCOMP; Manufacturer1 ComponentHeight: 0.4mm; HelpURL: \\cern.ch\dfs\Applications\Altium\Datasheets\R0402_Phycomp_RC0402.pdf; Author: CERN DEM JLC; CreateDate: 03.12.2007; LatestRevisionDate: 17.10.2012; ClassName: Artix

## Nets that join several sheets
GND: DIOT-mini-backplane (14 pins), Slot_periph (52 pins), EEM_Connectors (27 pins)
P12V: Slot_periph (7 pins), EEM_Connectors (6 pins)
CLK_N: DIOT-mini-backplane (C6.1 TR1.4), Slot_periph (J3.F4)
CLK_P: DIOT-mini-backplane (C4.2 TR1.6), Slot_periph (J3.E4)
DIFF_0_N: Slot_periph (J3.B3), EEM_Connectors (J4.3)
DIFF_0_P: Slot_periph (J3.A3), EEM_Connectors (J4.2)
DIFF_1_N: Slot_periph (J3.E3), EEM_Connectors (J4.6)
DIFF_1_P: Slot_periph (J3.D3), EEM_Connectors (J4.5)
DIFF_2_N: Slot_periph (J3.C4), EEM_Connectors (J4.9)
DIFF_2_P: Slot_periph (J3.B4), EEM_Connectors (J4.8)
DIFF_3_N: Slot_periph (J3.I4), EEM_Connectors (J4.12)
DIFF_3_P: Slot_periph (J3.H4), EEM_Connectors (J4.11)
DIFF_4_N: Slot_periph (J3.L4), EEM_Connectors (J4.15)
DIFF_4_P: Slot_periph (J3.K4), EEM_Connectors (J4.14)
DIFF_5_N: Slot_periph (J3.H5), EEM_Connectors (J4.18)
DIFF_5_P: Slot_periph (J3.G5), EEM_Connectors (J4.17)
DIFF_6_N: Slot_periph (J3.K5), EEM_Connectors (J4.21)
DIFF_6_P: Slot_periph (J3.J5), EEM_Connectors (J4.20)
DIFF_7_N: Slot_periph (J3.C6), EEM_Connectors (J4.24)
DIFF_7_P: Slot_periph (J3.B6), EEM_Connectors (J4.23)
DIFF_8_N: Slot_periph (J3.F6), EEM_Connectors (J6.3)
DIFF_8_P: Slot_periph (J3.E6), EEM_Connectors (J6.2)
DIFF_9_N: Slot_periph (J3.I6), EEM_Connectors (J6.6)
DIFF_9_P: Slot_periph (J3.H6), EEM_Connectors (J6.5)
DIFF_10_N: Slot_periph (J3.L6), EEM_Connectors (J6.9)
DIFF_10_P: Slot_periph (J3.K6), EEM_Connectors (J6.8)
DIFF_11_N: Slot_periph (J2.B1), EEM_Connectors (J6.12)
DIFF_11_P: Slot_periph (J2.A1), EEM_Connectors (J6.11)
DIFF_12_N: Slot_periph (J2.E1), EEM_Connectors (J6.15)
DIFF_12_P: Slot_periph (J2.D1), EEM_Connectors (J6.14)
DIFF_13_N: Slot_periph (J2.H1), EEM_Connectors (J6.18)
DIFF_13_P: Slot_periph (J2.G1), EEM_Connectors (J6.17)
DIFF_14_N: Slot_periph (J2.K1), EEM_Connectors (J6.21)
DIFF_14_P: Slot_periph (J2.J1), EEM_Connectors (J6.20)
DIFF_15_N: Slot_periph (J3.F2), EEM_Connectors (J6.24)
DIFF_15_P: Slot_periph (J3.E2), EEM_Connectors (J6.23)
GA0: DIOT-mini-backplane (C1.2), Slot_periph (J3.C3)
GA1: DIOT-mini-backplane (C2.2), Slot_periph (J3.F3)
GA2: DIOT-mini-backplane (C3.2), Slot_periph (J3.I3)
GA3: DIOT-mini-backplane (R1.2), Slot_periph (J3.L3)
I2C_SCL: Slot_periph (J3.B2), EEM_Connectors (IC2.13 R3.1 R5.1 R6.1)
I2C_SDA: Slot_periph (J3.C2), EEM_Connectors (IC2.12 R4.1 R7.1 R8.1)
RST_N: Slot_periph (J3.H2), EEM_Connectors (IC1.12 IC1.13 R15.2)
SERVMOD: Slot_periph (J3.K2), EEM_Connectors (IC1.15 R9.1 R14.2)

## Assembly variants
Full: all parts fitted
Default: all parts fitted